# EasyEDA Pro project Magmattic PCB_V2.eprj, board BB-ADS1262-Rev.A
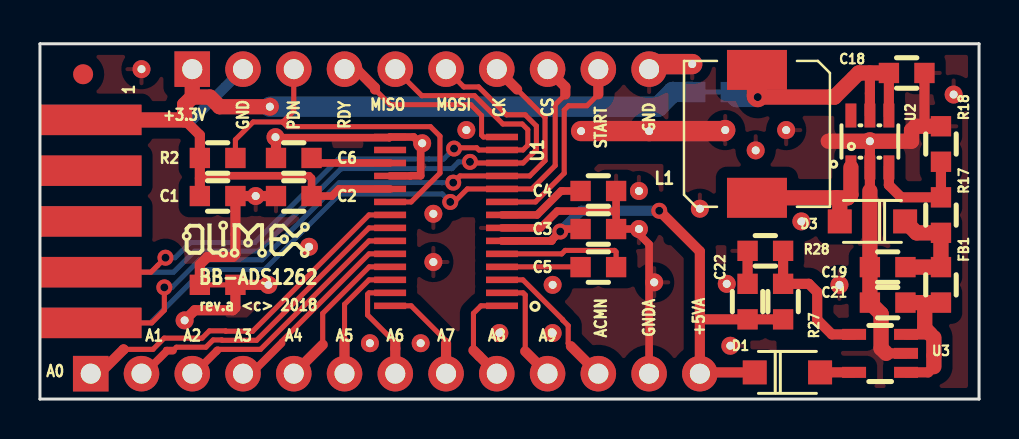
[diagram p8: board, top side]
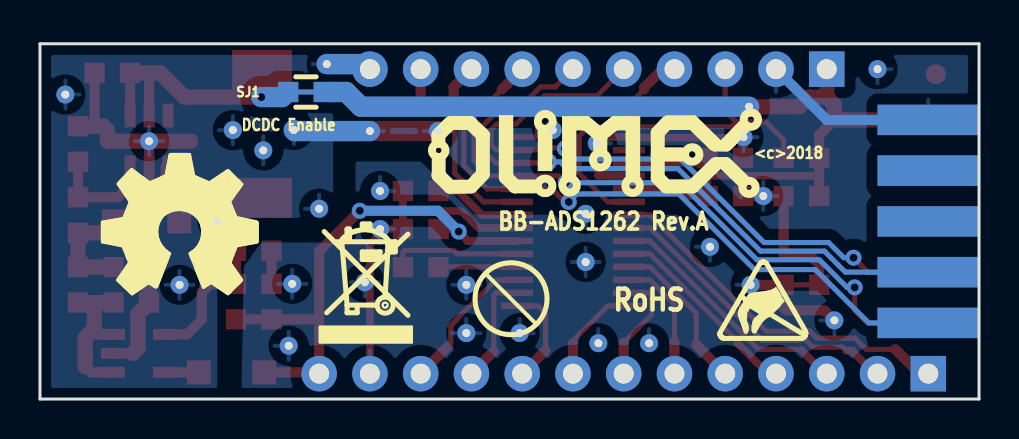
[diagram p9: board, bottom side, seen from below]

Outline 46.99 x 17.78 mm; copper layers: Top Layer, Bottom Layer. Coordinates in mm from the lower left corner of the outline.
Outline path: 0,17.78 46.99,17.78 46.99,0 0,0 0,17.78
Stack: Top Layer 0.035mm / Dielectric1 1.51mm FR4 er 4.5 / Bottom Layer 0.035mm

## Design rules (mm)
spacing safeClearance (default): track to track 0.152, other pairs 0.152 to 0.3
track width trackWidth (default): min 0.127, default 0.254, max 2.54
differential pair differentialPair (default): width min 0.127, default 0.254, max 2.54; gap min 0.152, default 0.152
via viaSize (default): diameter min 0.5, default 0.61, max 10; hole min 0.3, default 0.305, max 6
pour ie835 uses CopperRegion4
pour ie836 uses CopperRegion5
pour ie837 uses CopperRegion
pour ie838 uses CopperRegion1
pour ie839 uses CopperRegion2
pour ie840 uses CopperRegion3

## Placement (name value [footprint] x y rotation side)
C1  100nF  [OLIMEX_RLC-FP:C_0603_5MIL_DWS]  8.89 10.16 0 top
C2  100nF  [OLIMEX_RLC-FP:C_0603_5MIL_DWS]  12.7 10.16 180 top
C3  100nF  [OLIMEX_RLC-FP:C_0603_5MIL_DWS]  27.94 8.51 0 top
C4  1uF  [OLIMEX_RLC-FP:C_0603_5MIL_DWS]  27.94 10.41 0 top
C5  4.7nF  [OLIMEX_RLC-FP:C_0603_5MIL_DWS]  27.94 6.6 0 top
C6  1uF  [OLIMEX_RLC-FP:C_0603_5MIL_DWS]  12.7 12.06 180 top
C18  22uF/6.3V  [OLIMEX_RLC-FP:C_0603_5MIL_DWS]  43.37 16.32 0 top
C19  22uF/10V  [OLIMEX_RLC-FP:C_0603_5MIL_DWS]  42.42 6.6 180 top
C21  1uF  [OLIMEX_RLC-FP:C_0603_5MIL_DWS]  42.42 4.83 180 top
C22  1uF  [OLIMEX_RLC-FP:C_0603_5MIL_DWS]  35.41 4.88 90 top
CON1  CON14  [OLIMEX_Connectors-FP:HN1x13]  19.05 1.27 0 top
CON2  CON10  [OLIMEX_Connectors-FP:HN1x10]  19.05 16.51 0 top
CON3  BH10S  [OLIMEX_Connectors-FP:UEXTF]  -2.54 8.89 0 top
D1  1N5819/SS14  [OLIMEX_Diodes-FP:SOD-123_KA]  37.4 1.33 0 top
D3  1N5819/SS14  [OLIMEX_Diodes-FP:SOD-123_KA]  41.66 8.89 180 top
FB1  FB0603  [OLIMEX_RLC-FP:L_0603_5MIL_DWS]  45.08 5.71 270 top
L1  CL10 10uH SD73  [OLIMEX_RLC-FP:SD73]  35.88 13.27 0 top
NOREF  -  [OLIMEX_LOGOs-FP:OLIMEX_LOGO_SMALL_TB]  10.29 8 0 top
NOREF#2  -  [OLIMEX_LOGOs-FP:OLIMEX_LOGO_TB]  19.05 12.32 180 bottom
NOREF#3  -  [OLIMEX_LOGOs-FP:LOGO_PBFREE]  23.62 5.33 0 bottom
NOREF#4  -  [OLIMEX_LOGOs-FP:LOGO_RECYCLEBIN_1]  33.02 2.79 180 bottom
NOREF#5  -  [OLIMEX_LOGOs-FP:LOGO_OPENHARDWARE_8x8]  40.01 8.25 180 bottom
R1  0R  [OLIMEX_RLC-FP:R_0603_5MIL_0R(Board_Mounted)]  8.89 5.71 180 top
R2  1K  [OLIMEX_RLC-FP:R_0603_5MIL_DWS]  8.89 12.06 0 top
R17  12.1K_1%  [OLIMEX_RLC-FP:R_0603_5MIL_DWS]  45.08 9.21 90 top
R18  1.05K_1%  [OLIMEX_RLC-FP:R_0603_5MIL_DWS]  45.08 12.76 90 top
R27  5.6K_1%  [OLIMEX_RLC-FP:R_0603_5MIL_DWS]  37.19 4.88 90 top
R28  1.05K_1%  [OLIMEX_RLC-FP:R_0603_5MIL_DWS]  36.3 7.42 180 top
Ref*  Val**  [OLIMEX_Other-FP:Fiducial1x3_transp]  2.16 16.26 0 top
Ref**  -  [OLIMEX_Other-FP:via_09_07]  25.65 5.71 0 top
Ref**#2  -  [OLIMEX_Other-FP:via_09_07]  34.54 2.67 0 top
Ref**#3  -  [OLIMEX_Other-FP:via_09_07]  34.29 13.46 0 top
Ref**#4  -  [OLIMEX_Other-FP:via_09_07]  41.53 12.9 0 top
Ref**#5  -  [OLIMEX_Other-FP:via_09_07]  34.37 5.77 0 top
Ref**#6  -  [OLIMEX_Other-FP:via_09_07]  11.51 14.63 0 top
Ref**#7  -  [OLIMEX_Other-FP:via_09_07]  27.08 13.41 0 top
Ref**#8  -  [OLIMEX_Other-FP:via_09_07]  30.48 13.41 0 top
Ref**#9  -  [OLIMEX_Other-FP:via_09_07]  29.97 10.41 0 top
Ref**#10  -  [OLIMEX_Other-FP:via_09_07]  29.97 8.51 0 top
Ref**#11  -  [OLIMEX_Other-FP:via_09_07]  30.73 5.84 0 top
Ref**#12  -  [OLIMEX_Other-FP:via_09_07]  11.79 13.11 0 top
Ref**#13  -  [OLIMEX_Other-FP:via_09_07]  16.51 2.79 0 top
Ref**#14  -  [OLIMEX_Other-FP:via_09_07]  19.05 2.79 0 top
Ref**#15  -  [OLIMEX_Other-FP:via_09_07]  5.08 16.51 0 top
Ref**#16  -  [OLIMEX_Other-FP:via_09_07]  19.13 12.8 0 top
Ref**#17  -  [OLIMEX_Other-FP:via_09_07]  10.8 10.16 0 top
Ref**#18  -  [OLIMEX_Other-FP:via_09_07]  21.34 13.46 0 top
Ref**#19  -  [OLIMEX_Other-FP:via_09_07]  7.24 3.94 0 top
Ref**#20  -  [OLIMEX_Other-FP:via_09_07]  11.43 5.71 0 top
Ref**#21  -  [OLIMEX_Other-FP:via_09_07]  13.46 7.62 0 top
Ref**#22  -  [OLIMEX_Other-FP:via_09_07]  25.65 3.3 0 top
Ref**#23  -  [OLIMEX_Other-FP:via_09_07]  22.99 3.3 0 top
Ref**#24  -  [OLIMEX_Other-FP:via_09_07]  19.68 6.86 0 top
Ref**#25  -  [OLIMEX_Other-FP:via_09_07]  19.68 9.27 0 top
Ref**#26  -  [OLIMEX_Other-FP:via_09_07]  32.64 16.76 0 top
Ref**#27  -  [OLIMEX_Other-FP:via_09_07]  33.02 9.52 0 top
Ref**#28  -  [OLIMEX_Other-FP:via_09_07]  38.1 8.89 0 top
Ref**#29  -  [OLIMEX_Other-FP:via_09_07]  40.01 5.71 0 top
Ref**#30  -  [OLIMEX_Other-FP:via_09_07]  45.72 15.24 0 top
Ref**#31  -  [OLIMEX_Other-FP:via_09_07]  35.81 12.45 0 top
Ref**#32  -  [OLIMEX_Other-FP:via_09_07]  37.34 13.46 0 top
Ref**#33  -  [OLIMEX_LOGOs-FP:LOGO_ANTISTATIC_SMALL_4.5mmX2.8mm]  10.8 4.95 180 bottom
SJ1  SJ_Closed  [OLIMEX_RLC-FP:R_0603_5MIL_0R(Board_Mounted)]  33.68 15.37 0 bottom
U1  ADS1262  [OLIMEX_IC-FP:TSSOP28-PW]  20.32 8.89 180 top
U2  MT3608(SOT23-6)  [OLIMEX_Regulators-FP:SOT23-6]  41.53 12.89 270 top
U3  AP2127K-ADJ  [OLIMEX_Regulators-FP:SOT-23-5]  42.04 2.29 0 top

## Footprints (pads in the part's own frame, mm; a bottom-side part is the same pattern mirrored in y, then rotated)
OLIMEX_Connectors-FP:HN1x10
  rect 1.778x1.778 hole 1: 1(-11.43,0)
  round 1.778 hole 1: 2(-8.89,0) 3(-6.35,0) 4(-3.81,0) 5(-1.27,0) 6(1.27,0) 7(3.81,0) 8(6.35,0) 9(8.89,0) 10(11.43,0)
OLIMEX_Connectors-FP:HN1x13
  rect 1.778x1.778 hole 1: 1(-16.51,0)
  round 1.778 hole 1: 2(-13.97,0) 3(-11.43,0) 4(-8.89,0) 5(-6.35,0) 6(-3.81,0) 7(-1.27,0) 8(1.27,0) 9(3.81,0) 10(6.35,0) 11(8.89,0) 12(11.43,0) 13(13.97,0)
OLIMEX_Connectors-FP:UEXTF
  rect 5.08x1.524 smd: 1(5.08,5.08) 3(5.08,2.54) 5(5.08,0) 7(5.08,-2.54) 9(5.08,-5.08)
  rect 5.08x1.524 smd far side: 2(5.08,5.08) 4(5.08,2.54) 6(5.08,0) 8(5.08,-2.54) 10(5.08,-5.08)
OLIMEX_Diodes-FP:SOD-123_KA
  rect 1.2x1.2 smd: 1(-1.635,0) 2(1.635,0)
OLIMEX_IC-FP:TSSOP28-PW
  rect 1.6x0.325 smd: 1(-2.8,4.225) 2(-2.8,3.575) 3(-2.8,2.925) 4(-2.8,2.275) 5(-2.8,1.625) 6(-2.8,0.975) 7(-2.8,0.325) 8(-2.8,-0.325) 9(-2.8,-0.975) 10(-2.8,-1.625) 11(-2.8,-2.275) 12(-2.8,-2.925) 13(-2.8,-3.575) 14(-2.8,-4.225) 15(2.8,-4.225) 16(2.8,-3.575) 17(2.8,-2.925) 18(2.8,-2.275) 19(2.8,-1.625) 20(2.8,-0.975) 21(2.8,-0.325) 22(2.8,0.325) 23(2.8,0.975) 24(2.8,1.625) 25(2.8,2.275) 26(2.8,2.925) 27(2.8,3.575) 28(2.8,4.225)
OLIMEX_Other-FP:Fiducial1x3_transp
  round 1 smd: Fid1(0,0)
OLIMEX_Other-FP:via_09_07
  round 0.9 hole 0.4: 0(0,0)
OLIMEX_Regulators-FP:SOT23-6
  rect 1.2x0.55 smd: 1(1.3,-0.95) 2(1.3,0) 3(1.3,0.95) 4(-1.3,0.95) 5(-1.3,0) 6(-1.3,-0.95)
OLIMEX_Regulators-FP:SOT-23-5
  rect 1.2x0.55 smd: 1(1.3,-0.95) 2(1.3,0) 3(1.3,0.95) 4(-1.3,0.95) 5(-1.3,-0.95)
OLIMEX_RLC-FP:C_0603_5MIL_DWS
  rect 1.016x1.016 smd: 1(-0.889,0) 2(0.889,0)
OLIMEX_RLC-FP:L_0603_5MIL_DWS
  rect 1.016x1.016 smd: 1(-0.889,0) 2(0.889,0)
OLIMEX_RLC-FP:R_0603_5MIL_0R(Board_Mounted)
  rect 1.016x1.016 smd: 1(-0.889,0) 2(0.889,0)
OLIMEX_RLC-FP:R_0603_5MIL_DWS
  rect 1.016x1.016 smd: 1(-0.889,0) 2(0.889,0)
OLIMEX_RLC-FP:SD73
  rect 3x2 smd: 1(0,3.2) 2(0,-3.2)

## Nets
+3.3VD: C1.1 C2.1 CON2.1 CON3.1 R2.1 Ref**#6.0 SJ1.1 U1.19
+5VA: C3.1 C22.1 CON1.13 D1.1 R27.1 U1.6
GNDA: C3.2 C4.2 C22.2 CON1.12 R1.1 R28.2 Ref**.0 Ref**#2.0 Ref**#5.0 Ref**#9.0 Ref**#10.0 Ref**#11.0 Ref**#13.0 Ref**#14.0 Ref**#19.0 Ref**#20.0 Ref**#21.0 Ref**#22.0 Ref**#23.0 Ref**#24.0 Ref**#25.0 U1.7
GNDD: C1.2 C2.2 C6.2 C18.2 C19.2 C21.2 CON2.2 CON2.10 CON3.2 R1.2 R18.2 Ref**#3.0 Ref**#4.0 Ref**#7.0 Ref**#8.0 Ref**#12.0 Ref**#15.0 Ref**#16.0 Ref**#17.0 Ref**#18.0 Ref**#26.0 Ref**#27.0 Ref**#28.0 Ref**#29.0 Ref**#30.0 Ref**#31.0 Ref**#32.0 U1.15 U1.18 U2.2 U3.2
/AIN0: CON1.1 U1.21
/AIN1: CON1.2 U1.22
/AIN2: CON1.3 U1.23
/AIN3: CON1.4 U1.24
/AIN4: CON1.5 U1.25
/AIN5: CON1.6 U1.26
/AIN6: CON1.7 U1.27
/AIN7: CON1.8 U1.28
/AIN8: CON1.9 U1.1
/AIN9: CON1.10 U1.2
/AINCOM: CON1.11 U1.3
/CS#: CON2.8 CON3.10 U1.10
/DRDY#: CON2.4 U1.14
/MISO: CON2.5 CON3.7 U1.13
/MOSI: CON2.6 CON3.8 U1.12
/PWDN#: CON2.3 R2.2 U1.20
/SCK: CON2.7 CON3.9 U1.11
/START: CON2.9 U1.9
NET-(C4-PAD1): C4.1 U1.8
NET-(C5-PAD1): C5.1 U1.4
NET-(C5-PAD2): C5.2 U1.5
NET-(C6-PAD1): C6.1 U1.17
NET-(C18-PAD1): C18.1 L1.1 SJ1.2 U2.4 U2.5
NET-(C19-PAD1): C19.1 D3.1 FB1.1 R17.1
NET-(C21-PAD1): C21.1 FB1.2 U3.1 U3.3
NET-(CON3-PAD3): CON3.3
NET-(CON3-PAD4): CON3.4
NET-(CON3-PAD5): CON3.5
NET-(CON3-PAD6): CON3.6
NET-(D1-PAD2): D1.2 U3.5
NET-(D3-PAD2): D3.2 L1.2 U2.1
NET-(R17-PAD2): R17.2 R18.1 U2.3
NET-(R27-PAD2): R27.2 R28.1 U3.4
NET-(U1-PAD16): U1.16
NET-(U2-PAD6): U2.6

Pads without a net: Ref* Fid1

## Via types
v1: diameter 0.8, hole 0.4, Top Layer to Bottom Layer, 9 vias

## Routing (per net, layer and track width the routed paths; a pad name or vN(x,y) marks a point on that pad's centre or on a via; arc(x,y) is an arc through that point)
+3.3VD: length 47.7
  Top Layer w0.381: U1.19 14.96,10.52 14.61,10.16 C2.1 13.59,11.05 13.46,11.18 8.13,11.18 8,11.05
  Top Layer w0.508: 7.24,13.97 8,13.21 R2.1 C1.1
  Top Layer w0.762: Ref**#6.0 8.99,14.63 8.51,15.11 7.62,15.11 ; 7.62,15.11 7.24,14.73 7.24,13.97 CON3.1 ; 7.62,15.11 CON2.1
  Bottom Layer w1.016: Ref**#6.0 30.93,14.63 31.67,15.37 32.64,15.37
+5VA: length 28.6
  Top Layer w0.381: C3.1 26.16,8.51 25.62,7.97 25.62,7.91 23.12,7.91 25.57,7.91 v1(26.04,8.38)
  Top Layer w0.508: v1(30.99,9.42) 33.02,7.39 33.02,3.96 ; 33.02,3.96 33.05,3.99 C22.1 R27.1 ; 33.02,3.96 CON1.13 33.08,1.33 D1.1
  Bottom Layer w0.508: v1(26.04,8.38) 27.08,9.42 v1(30.99,9.42)
GNDA: length 23.7
  Top Layer w0.381: 28.82,9.41 25.89,9.41 25.05,8.56 U1.7 ; 28.82,9.41 28.83,9.42 C4.2 ; 28.82,9.41 28.83,9.4 C3.2 29.72,8.51 30.48,7.75 CON1.12
  Top Layer w0.508: R28.2 C22.2 ; Ref**#19.0 7.75,4.44 9.65,4.44 9.78,4.57 R1.1 Ref**#20.0
GNDD: length 64.7
  Top Layer w0.381: 11.81,13.08 17.49,13.08 U1.15 18.7,13.11 19.05,12.77 19.05,11.18 18.54,11.18 18.53,11.16 U1.18
  Top Layer w0.508: R1.2 8,6.73 8.38,7.11 9.65,7.11 9.78,7.24 C1.2 C2.2 ; 41.53,10.41 U2.2 Ref**#4.0 ; C18.2 44.26,13.69 44.3,13.65 ; U3.2 42.34,2.29 ; C6.2 11.81,13.08
  Top Layer w0.762: 42.34,2.29 42.09,2.54 42.09,4.27 41.53,4.83 41.53,10.41 ; 39.45,12.9 Ref**#4.0 43.61,12.9 43.61,13.45 43.82,13.65 R18.2
  Top Layer w1.016: Ref**#26.0 30.73,16.76 CON2.10 ; Ref**#7.0 Ref**#8.0 34.24,13.41 Ref**#3.0
  Bottom Layer w0.508: CON2.2 7.62,13.97 CON3.2
  Bottom Layer w1.016: Ref**#26.0 30.73,16.76 CON2.10 ; Ref**#8.0 34.24,13.41 Ref**#3.0
/AIN0: length 18.3
  Top Layer w0.254: 17.52,9.21 16.47,9.21 10.64,3.39 9.3,3.39 9.28,3.41 8.48,3.41 8.11,3.05 6.22,3.05 5.65,2.49 4.19,2.49 4.19,2.48
  Top Layer w0.508: CON1.1 2.97,1.27 4.18,2.48 4.19,2.48
/AIN1: length 15.8
  Top Layer w0.254: U1.22 16.47,8.56 10.84,2.94 9.11,2.94 9.1,2.96 8.67,2.96 8.3,2.59 6.83,2.59 6.65,2.42 6.3,2.49
  Top Layer w0.381: 6.65,2.42 6.36,2.42 5.21,1.27 CON1.2
/AIN2: length 12.7
  Top Layer w0.254: 8.84,2.49 8.88,2.44 8.93,2.49 11.04,2.49 16.47,7.91 17.52,7.91
  Top Layer w0.381: CON1.3 7.71,1.27 8.88,2.44
/AIN3: length 9.9
  Top Layer w0.254: 12.09,2.79 12.09,2.89 16.47,7.27 U1.24
  Top Layer w0.381: CON1.4 10.57,1.27 12.09,2.79
/AIN4: length 8
  Top Layer w0.254: U1.25 16.47,6.61 14.15,4.29 14.15,2.72
  Top Layer w0.508: CON1.5 14.15,2.72
/AIN5: length 6.3
  Top Layer w0.254: 15.24,2.87 15.24,4.74 16.47,5.96 U1.26
  Top Layer w0.508: CON1.6 15.24,2.87
/AIN6: length 5.7
  Top Layer w0.254: U1.27 16.47,5.31 16.39,5.24 16.39,4.21 17.78,2.82
  Top Layer w0.508: CON1.7 17.78,2.82
/AIN7: length 5.2
  Top Layer w0.254: U1.28 18.57,4.66 20.32,2.92 20.32,2.79
  Top Layer w0.508: CON1.8 20.32,2.79
/AIN8: length 5.1
  Top Layer w0.254: 21.69,2.44 21.69,4.29 22.07,4.66 U1.1
  Top Layer w0.508: CON1.9 21.69,2.44
/AIN9: length 5.6
  Top Layer w0.254: U1.2 24.17,5.31 24.28,5.21 24.28,2.39
  Top Layer w0.508: CON1.10 24.28,2.39
/AINCOM: length 7.3
  Top Layer w0.254: U1.3 24.17,5.96 26.16,3.97 26.16,3.94 26.43,3.67 26.43,2.78 26.57,2.64
  Top Layer w0.508: CON1.11 26.57,2.64
/CS#: length 32.2
  Top Layer w0.254: 26.29,15.24 25.78,14.73 25.78,11.68 24.61,10.52 U1.10 21.38,10.52 20.73,9.86 v1(20.53,9.86)
  Top Layer w0.508: CON2.8 26.29,15.62 26.29,15.24
  Bottom Layer w0.254: v1(20.53,9.86) 20.13,10.26 15.02,10.26 11.23,6.48 8.19,6.48 5.52,3.81 CON3.10
/DRDY#: length 9.9
  Top Layer w0.25: 16.76,15.49 17.53,14.73 21.56,14.73 22.1,14.19 22.1,13.21 22.19,13.11 U1.14
  Top Layer w0.508: 16.76,15.49 16.76,15.58 15.84,16.51 CON2.4
/MISO: length 33.3
  Top Layer w0.25: U1.13 24.17,12.46 24.41,12.71 24.41,13.48 24.13,13.77
  Top Layer w0.254: v1(20.72,12.54) 20.76,12.57 21.86,12.57 21.96,12.46 U1.13 ; 24.13,13.77 23.16,13.77 21.74,15.18 19.11,15.18 CON2.5 ; CON3.7 5.56,6.35 5.88,6.67 v1(6.28,7.07)
  Bottom Layer w0.254: v1(20.72,12.54) 20.2,12.01 14.93,12.01 10.75,7.83 7.53,7.83 6.77,7.07 v1(6.28,7.07)
/MOSI: length 31.8
  Top Layer w0.254: v1(21.52,11.87) 21.57,11.81 U1.12 24.17,11.81 24.84,12.48 24.84,13.66 24.28,14.22 23.35,14.22 21.95,15.62 21.21,15.62 CON2.6
  Bottom Layer w0.254: CON3.8 6.68,6.35 7.74,7.4 10.93,7.4 15.06,11.53 20.61,11.53 20.95,11.87 v1(21.52,11.87)
/PWDN#: length 19.6
  Top Layer w0.254: U1.20 18.57,9.86 20.02,11.31 20.02,13.16 19.54,13.63 12.38,13.63 12.15,13.86 ; R2.2 9.78,12.98 10.67,13.87 12.14,13.87 12.15,13.86 ; 12.15,13.86 12.7,14.41 CON2.3
/SCK: length 32.3
  Top Layer w0.254: 23.88,15.49 25.27,14.1 25.27,11.93 24.51,11.16 U1.11 21.01,11.16 v1(20.68,10.83) ; v1(6.22,5.59) 6.22,4.44 5.59,3.81 CON3.9
  Top Layer w0.508: CON2.7 23.88,15.49
  Bottom Layer w0.254: v1(6.22,5.59) 6.6,5.59 7.99,6.97 11.11,6.97 14.97,10.83 v1(20.68,10.83)
/START: length 10.2
  Top Layer w0.254: U1.9 24.79,9.86 26.23,11.3 26.23,14.46 26.45,14.68 27.37,14.68 27.94,15.25
  Top Layer w0.508: CON2.9 27.94,15.25
NET-(C4-PAD1): length 4.4
  Top Layer w0.381: 23.12,9.21 24.88,9.21 26.08,10.41 C4.1
NET-(C5-PAD1): length 3.9
  Top Layer w0.254: U1.4 27.04,6.61 C5.1
NET-(C5-PAD2): length 6.6
  Top Layer w0.254: U1.5 26.11,7.27 26.28,7.44 28.76,7.44 28.83,7.37 C5.2
NET-(C6-PAD1): length 4
  Top Layer w0.381: U1.17 13.84,11.81 C6.1
NET-(C18-PAD1): length 14.1
  Top Layer w0.508: U2.4 42.48,16.32 C18.1 ; 41.53,16.32 U2.5
  Top Layer w0.762: C18.1 40.97,16.32 39.76,15.11 v1(35.92,15.11)
  Top Layer w1.016: v1(35.92,15.11) 35.88,15.15 L1.1
  Bottom Layer w1.016: 34.62,15.37 34.87,15.11 v1(35.92,15.11)
NET-(C19-PAD1): length 5.5
  Top Layer w0.762: D3.1 43.86,8.32 R17.1 FB1.1 C19.1
NET-(C21-PAD1): length 7.9
  Top Layer w0.508: U3.1 44.45,1.34 44.73,1.62 ; 44.73,3.07 44.57,3.24 U3.3
  Top Layer w0.762: 44.27,4.83 FB1.2 ; 44.27,4.83 C21.1 ; 44.27,4.83 44.27,3.53 44.57,3.24 ; 44.73,3.07 44.73,1.62
NET-(D1-PAD2): length 1.7
  Top Layer w0.508: 40.74,1.34 39.04,1.34 D1.2
NET-(D3-PAD2): length 7.4
  Top Layer w0.762: 39.87,10.07 40.02,9.92 D3.2 ; 39.87,10.07 L1.2 ; 39.87,10.07 40.42,10.07 40.58,10.23 40.58,11.59
NET-(R17-PAD2): length 5.5
  Top Layer w0.508: R18.1 R17.2 43.09,10.1 42.48,10.71 U2.3
NET-(R27-PAD2): length 7.1
  Top Layer w0.508: R28.1 R27.2 38.47,5.77 38.89,5.34 38.89,3.97 39.63,3.24 40.74,3.24

## Copper pours and planes (outline as drawn; the poured copper is in the pictures)
GNDA on Top Layer: 37.21,-0.13 37.08,6.6 35.94,8 31.5,8 31.5,12.06 27.81,12.06 25.15,9.4 14.99,9.4 11.18,5.59 9.27,5.59 9.27,4.57 0,4.57 0,-0.13
GNDA on Bottom Layer: 37.21,0 37.08,6.73 36.07,8.13 31.5,8.13 31.5,12.19 27.81,12.19 25.15,9.52 14.99,9.52 11.18,5.71 7.87,5.71 6.86,4.7 0,4.7 0,0
GNDD on Top Layer: 32,17.78 32,8.79 34.49,8.79 36.55,8.64 37.8,6.98 37.8,-0.03 46.96,-0.03 46.94,17.78
GNDD on Top Layer: 31.75,17.65 31.75,12.83 27.75,12.76 25.08,10.1 15.05,10.1 10.1,6.54 8.19,6.54 6.67,5.02 0.19,5.02 0.06,17.59
GNDD on Bottom Layer: 31.69,17.84 31.69,13.02 27.69,12.95 25.02,10.29 14.99,10.29 10.03,6.73 8.13,6.73 6.6,5.21 0.13,5.21 0,17.78
GNDD on Bottom Layer: 32.03,17.78 32,8.76 36.45,8.76 37.82,6.98 37.82,-0.03 46.99,-0.03 46.96,17.78

## Text on the board
Bottom Silkscreen Layer: <c>2018 | DCDC Enable | BB-ADS1262 Rev.A | RoHS
Top Silkscreen Layer: A0 | A1 | +3.3V | A2 | A3 | rev.a <c> 2018 | A4 | A5 | MISO | A6 | A7 | MOSI | A8 | A9 | 1 | GND | PDN | RDY | CK | CS | START | ACMN | GNDA | +5VA | BB-ADS1262
